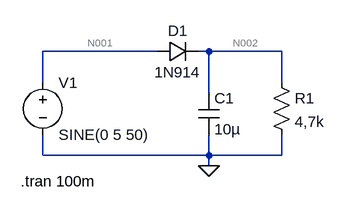
[diagram p0: schematic sim1shema.asc]
sim1shema.asc, the LTspice schematic file:
Version 4
SHEET 1 880 680
WIRE 160 112 -16 112
WIRE 240 112 224 112
WIRE 352 112 240 112
WIRE -16 160 -16 112
WIRE 352 160 352 112
WIRE 240 176 240 112
WIRE -16 272 -16 240
WIRE 240 272 240 240
WIRE 240 272 -16 272
WIRE 352 272 352 240
WIRE 352 272 240 272
WIRE 240 288 240 272
FLAG 240 288 0
SYMBOL diode 160 96 M90
WINDOW 0 0 32 VBottom 2
WINDOW 3 32 32 VTop 2
SYMATTR InstName D1
SYMATTR Value 1N914
SYMBOL voltage -16 144 R0
WINDOW 123 0 0 Left 2
WINDOW 39 0 0 Left 2
SYMATTR InstName V1
SYMATTR Value SINE(0 5 50)
SYMBOL res 336 144 R0
SYMATTR InstName R1
SYMATTR Value 4,7k
SYMBOL cap 224 176 R0
SYMATTR InstName C1
SYMATTR Value 10µ
TEXT -50 312 Left 2 !.tran 100m

The netlist it stands for:
* sim1shema.asc
D1 N001 N002 1N914
V1 N001 0 SINE(0 5 50)
R1 N002 0 4,7k
C1 N002 0 10µ
.model D D
.lib standard.dio
.tran 100m
.backanno
.end

* Results of the author's LTspice run, read from the files saved beside the schematic
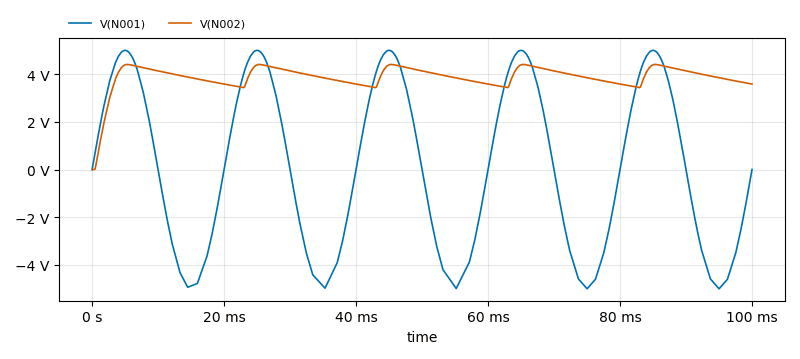
[diagram p1: Transient Analysis of sim1shema.asc, plotted from the saved traces]
* Transient Analysis, 1 run:
*   V(N001): min -4.999 V, max 4.999 V, average 20.82 mV, rms 3.516 V, last 0 V
*   V(N002): min 0 V, max 4.408 V, average 3.867 V, rms 3.904 V, last 3.586 V